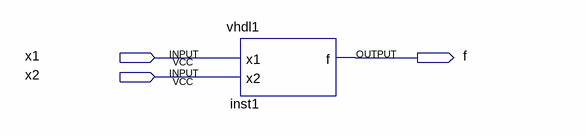
[diagram p0: schematic sheet]
// Quartus schematic intro_vhdl.bdf as structural Verilog: 1 symbols, 3 pins
module intro_vhdl (
  input  x1,
  input  x2,
  output f
);

  vhdl1 inst1 (.x1(x1), .x2(x2), .f(f));
endmodule
